# EAGLE design Teensy4Breakout (EAGLE 8.6.0)
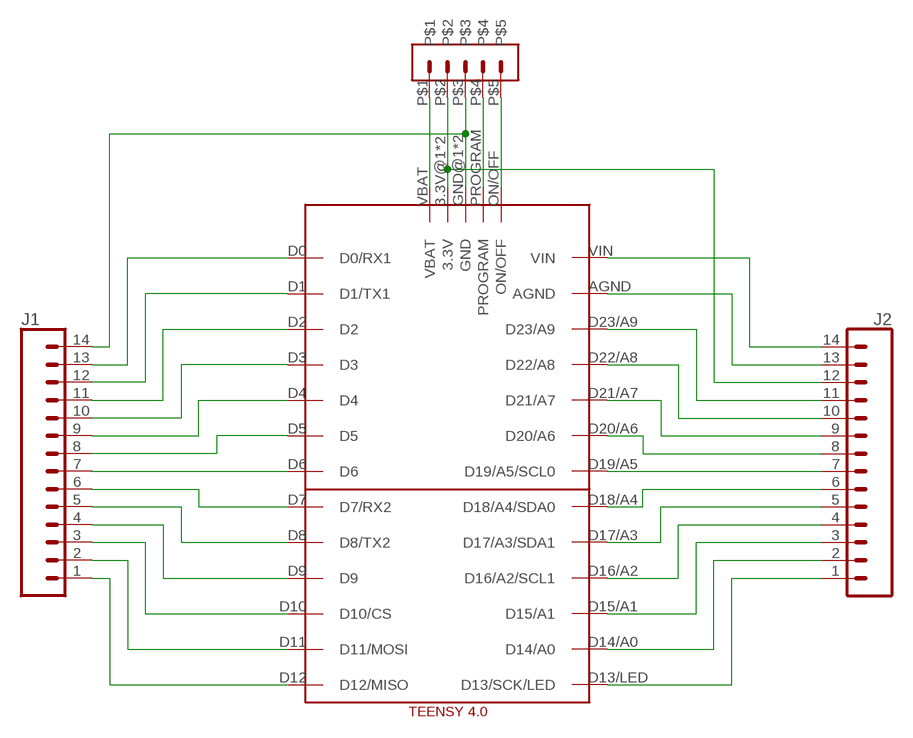
[diagram p0: schematic, sheet 1]

## Parts
J1  CONN_14LONGPADS  [1X14-LONGPADS]
J2  CONN_14LONGPADS  [1X14-LONGPADS]
U$1  HEADER1X5  [HEADER1X5]
U$4  TEENSY4.0-NOPOGO  [TEENSY4.0-NOPOGO]

## Nets
N$1: U$1.P$1 U$4.VBAT
N$2: J2.12 U$1.P$2 U$4.3.3V@1(3.3V) U$4.3.3V@2(3.3V)
N$3: J1.14 U$1.P$3 U$4.GND@1(GND) U$4.GND@2(GND)
N$4: U$1.P$4 U$4.PROGRAM
N$5: U$1.P$5 U$4.ON/OFF
N$6: J1.11 U$4.D2
N$7: J1.13 U$4.D0(D0/RX1)
N$8: J1.12 U$4.D1(D1/TX1)
N$9: J1.10 U$4.D3
N$10: J1.9 U$4.D4
N$11: J1.8 U$4.D5
N$12: J1.7 U$4.D6
N$13: J1.6 U$4.D7(D7/RX2)
N$14: J1.5 U$4.D8(D8/TX2)
N$15: J1.4 U$4.D9
N$16: J1.3 U$4.D10(D10/CS)
N$17: J1.2 U$4.D11(D11/MOSI)
N$18: J1.1 U$4.D12(D12/MISO)
N$19: J2.14 U$4.VIN
N$20: J2.13 U$4.AGND
N$21: J2.11 U$4.D23/A9
N$22: J2.10 U$4.D22/A8
N$23: J2.9 U$4.D21/A7
N$24: J2.8 U$4.D20/A6
N$25: J2.7 U$4.D19/A5(D19/A5/SCL0)
N$26: J2.6 U$4.D18/A4(D18/A4/SDA0)
N$27: J2.5 U$4.D17/A3(D17/A3/SDA1)
N$28: J2.4 U$4.D16/A2(D16/A2/SCL1)
N$29: J2.3 U$4.D15/A1
N$30: J2.2 U$4.D14/A0
N$31: J2.1 U$4.D13/LED(D13/SCK/LED)

## Library data of the parts
J1 J2 = SparkFun-Connectors:CONN_14: Multi connection point. Often used as Generic Header-pin footprint for 0.1 inch spaced/style header connections On any of the 0.1 inch spaced packages, you can populate with these: Break Away Headers - Straight <https://www.sparkfun.com/products/116> (PRT-00116) Break Away Male Headers - Right Angle <https://www.sparkfun.com/products/553> (PRT-00553) Female Headers <https://www.sparkfun.com/products/115> (PRT-00115) Break Away Headers - Machine Pin <https://www.sparkfun.com/products/117> (PRT-00117) Break Away Female Headers - Swiss Machine Pin <https://www.sparkfun.com/products/743> (PRT-00743) For SCREWTERMINALS and SPRING TERMINALS visit here: Screw Terimnals on SparkFun.com <https://www.sparkfun.com/search/results?term=Screw+Terminals> (5mm/3.5mm/2.54mm spacing) This device is also useful as a general connection point to wire up your design to another part of your project. Our various solder wires solder well into these plated through hole pads. Hook-Up Wire - Assortment (Stranded, 22 AWG) <https://www.sparkfun.com/products/11375> (PRT-11375) Hook-Up Wire - Assortment (Solid Core, 22 AWG) <https://www.sparkfun.com/products/11367> (PRT-11367) View the entire wire category on our website here <https://www.sparkfun.com/categories/141> Special notes: Molex polarized connector foot print use with SKU : PRT-08231 with associated crimp pins and housings. 1MM SMD Version SKU: PRT-10208 NOTES ON THE VARIANTS LOCK and LOCK_LONGPADS... This footprint was designed to help hold the alignment of a through-hole component (i.e. 6-pin header) while soldering it into place. You may notice that each hole has been shifted either up or down by 0.005 of an inch from it's more standard position (which is a perfectly straight line). This slight alteration caused the pins (the squares in the middle) to touch the edges of the holes. Because they are alternating, it causes a "brace" to hold the component in place. 0.005 has proven to be the perfect amount of "off-center" position when using our standard breakaway headers. Although looks a little odd when you look at the bare footprint, once you have a header in there, the alteration is very hard to notice. Also,if you push a header all the way into place, it is covered up entirely on the bottom side.
U$1 = BantamLibrary:HEADER1X5
U$4 = Teensy4.0FULL:TEENSY4.0-NOPOGO

## Board
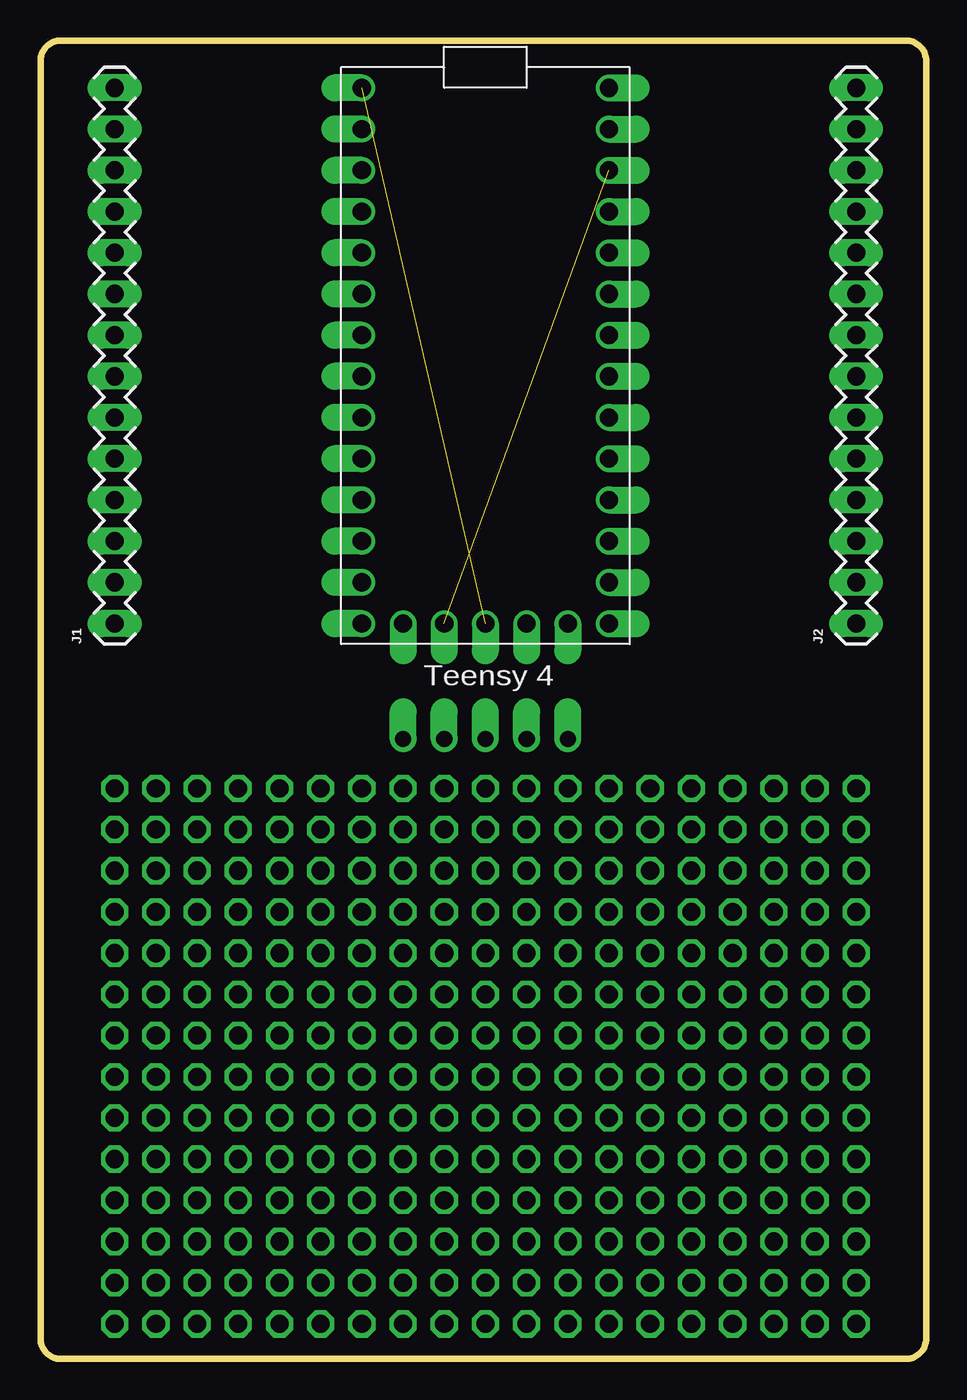
[diagram p1: board, top side]
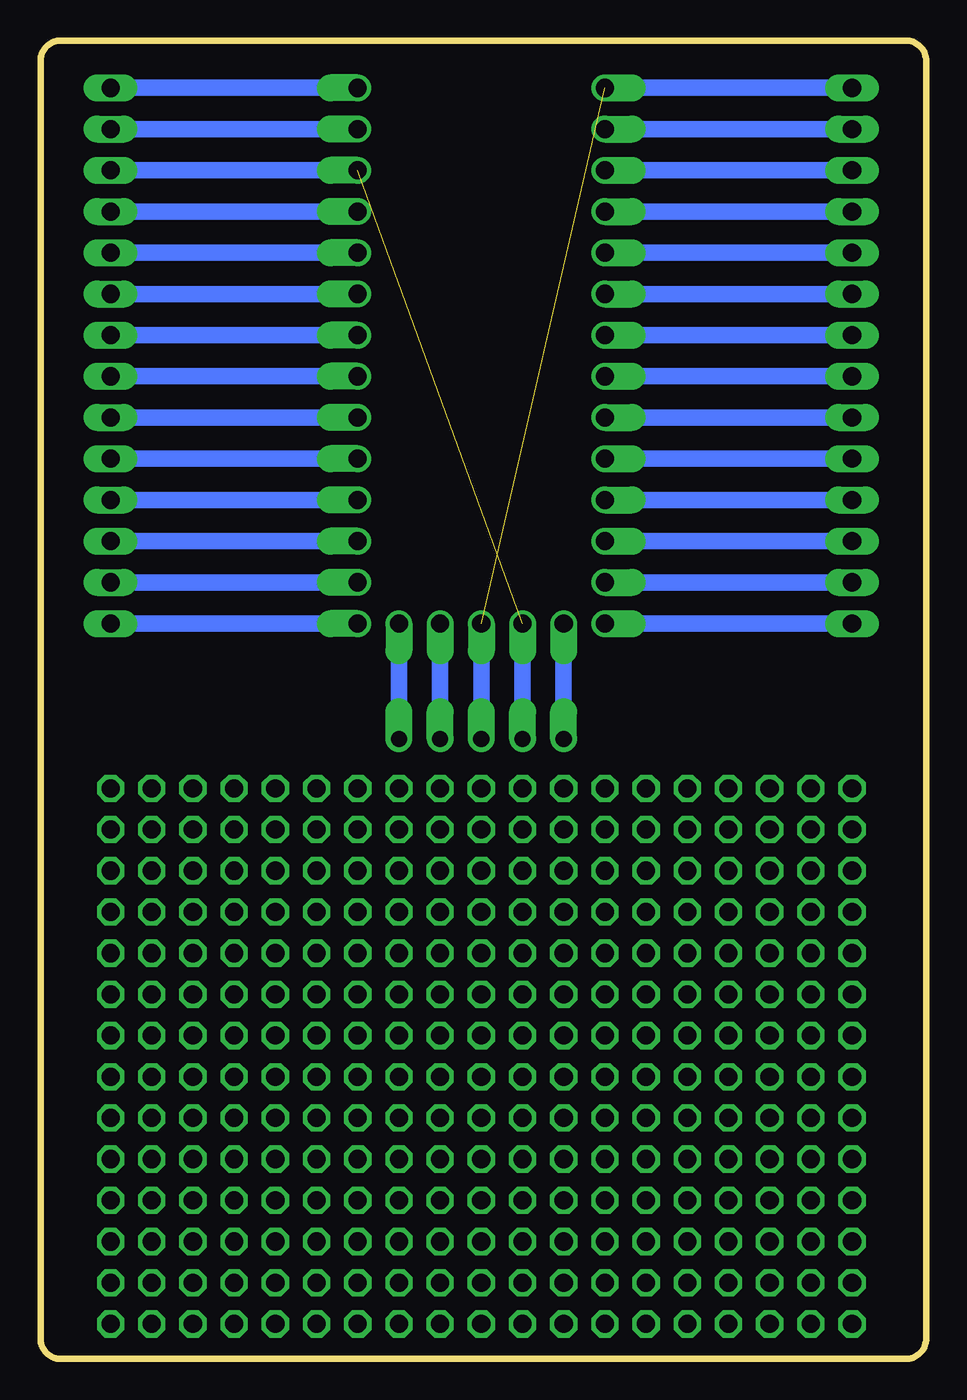
[diagram p2: board, bottom side, seen from below]

Size 54.61 x 81.28 mm. Coordinates in mm from the lower left corner, seen from the top.
Outline: 0,80.01 0,1.27 arc90 1.27,0 53.34,0 arc90 54.61,1.27 54.61,80.01 arc90 53.34,81.28 1.27,81.28 arc90 0,80.01
Copper layers (1*16): Top 0.035mm / dielectric 1.5mm / Bottom 0.035mm
Design rules "default": minimum track width 6mil, minimum drill 0.35mm, track to track 6mil, track to pad 6mil, pad to pad 6mil, via to via 6mil, smd to smd 6mil, copper to edge 40mil, drill to drill 6mil, minimum pad ring 10mil, minimum via ring 8mil, stop-mask expansion 4mil, vias tented up to drill 0mil, thermal gap 10mil

### Footprints (pad centres in the part's own frame; a part is rotated, then mirrored left to right if it is on the bottom)
1X14-LONGPADS = drill 1.118 long: 1 0,0; 2 2.54,0; 3 5.08,0; 4 7.62,0; 5 10.16,0; 6 12.7,0; 7 15.24,0; 8 17.78,0; 9 20.32,0; 10 22.86,0; 11 25.4,0; 12 27.94,0; 13 30.48,0; 14 33.02,0
HEADER1X5 = drill 1 pad 1.676 offset: P$1 -6.35,0; P$2 -3.81,0; P$3 -1.27,0; P$4 1.27,0; P$5 3.81,0
TEENSY4.0-NOPOGO = drill 1.118 offset: 3.3V@1 11.43,13.97; 3.3V@2 1.27,-13.97; AGND 11.43,16.51; D0 -3.81,16.51; D1 -3.81,13.97; D2 -3.81,11.43; D3 -3.81,8.89; D4 -3.81,6.35; D5 -3.81,3.81; D6 -3.81,1.27; D7 -3.81,-1.27; D8 -3.81,-3.81; D9 -3.81,-6.35; D10 -3.81,-8.89; D11 -3.81,-11.43; D12 -3.81,-13.97; D13/LED 11.43,-13.97; D14/A0 11.43,-11.43; D15/A1 11.43,-8.89; D16/A2 11.43,-6.35; D17/A3 11.43,-3.81; D18/A4 11.43,-1.27; D19/A5 11.43,1.27; D20/A6 11.43,3.81; D21/A7 11.43,6.35; D22/A8 11.43,8.89; D23/A9 11.43,11.43; GND@1 -3.81,19.05; GND@2 3.81,-13.97; ON/OFF 8.89,-13.97; PROGRAM 6.35,-13.97; VBAT -1.27,-13.97; VIN 11.43,19.05 | drill 1.118 pad 1.676 octagon: P$1 11.43,-24.13; P$2 13.97,-24.13; P$3 16.51,-24.13; P$4 19.05,-24.13; P$5 21.59,-24.13; P$6 26.67,-24.13; P$7 24.13,-24.13; P$22 26.67,-57.15; P$23 26.67,-54.61; P$24 26.67,-52.07; P$25 26.67,-49.53; P$26 26.67,-46.99; P$27 26.67,-44.45; P$28 26.67,-41.91; P$29 26.67,-39.37; P$30 26.67,-36.83; P$31 26.67,-34.29; P$32 26.67,-31.75; P$33 26.67,-29.21; P$34 26.67,-26.67; P$35 24.13,-26.67; P$36 24.13,-31.75; P$37 24.13,-29.21; P$38 24.13,-34.29; P$39 24.13,-36.83; P$40 24.13,-39.37; P$41 24.13,-41.91; P$42 24.13,-44.45; P$43 24.13,-46.99; P$44 24.13,-49.53; P$45 24.13,-52.07; P$46 24.13,-54.61; P$47 24.13,-57.15; P$48 21.59,-57.15; P$49 21.59,-54.61; P$50 21.59,-52.07; P$51 21.59,-49.53; P$52 21.59,-46.99; P$53 21.59,-44.45; P$54 21.59,-41.91; P$55 21.59,-39.37; P$56 21.59,-36.83; P$57 21.59,-34.29; P$58 21.59,-31.75; P$59 21.59,-29.21; P$60 21.59,-26.67; P$61 19.05,-26.67; P$62 19.05,-29.21; P$63 19.05,-31.75; P$64 19.05,-34.29; P$65 19.05,-36.83; P$66 19.05,-39.37; P$67 19.05,-41.91; P$68 19.05,-44.45; P$69 19.05,-46.99; P$70 19.05,-49.53; P$71 19.05,-52.07; P$72 19.05,-54.61; P$73 19.05,-57.15; P$74 16.51,-57.15; P$75 16.51,-54.61; P$76 16.51,-52.07; P$77 16.51,-49.53; P$78 16.51,-46.99; P$79 16.51,-44.45; P$80 16.51,-41.91; P$81 16.51,-39.37; P$82 16.51,-36.83; P$83 16.51,-34.29; P$84 16.51,-31.75; P$85 16.51,-29.21; P$86 16.51,-26.67; P$87 13.97,-26.67; P$88 11.43,-26.67; P$89 11.43,-29.21; P$90 13.97,-29.21; P$91 11.43,-31.75; P$92 13.97,-31.75; P$93 11.43,-34.29; P$94 13.97,-34.29; P$95 11.43,-36.83; P$96 13.97,-36.83; P$97 11.43,-39.37; P$98 13.97,-39.37; P$99 11.43,-41.91; P$100 13.97,-41.91; P$101 11.43,-44.45; P$102 13.97,-44.45; P$103 11.43,-46.99; P$104 13.97,-46.99; P$105 11.43,-49.53; P$106 13.97,-49.53; P$107 11.43,-52.07; P$108 13.97,-52.07; P$109 13.97,-54.61; P$110 11.43,-54.61; P$111 11.43,-57.15; P$112 13.97,-57.15; P$113 8.89,-24.13; P$114 6.35,-24.13; P$115 8.89,-26.67; P$116 6.35,-26.67; P$117 8.89,-29.21; P$118 6.35,-29.21; P$119 8.89,-31.75; P$120 6.35,-31.75; P$121 8.89,-34.29; P$122 6.35,-34.29; P$123 8.89,-36.83; P$124 6.35,-36.83; P$125 8.89,-39.37; P$126 6.35,-39.37; P$127 8.89,-41.91; P$128 6.35,-41.91; P$129 8.89,-44.45; P$130 6.35,-44.45; P$131 8.89,-46.99; P$132 6.35,-46.99; P$133 8.89,-49.53; P$134 6.35,-49.53; P$135 8.89,-52.07; P$136 6.35,-52.07; P$137 8.89,-54.61; P$138 6.35,-54.61; P$139 8.89,-57.15; P$140 6.35,-57.15; P$141 -13.97,-24.13; P$142 -11.43,-24.13; P$143 -8.89,-24.13; P$144 -6.35,-24.13; P$145 -3.81,-24.13; P$146 1.27,-24.13; P$147 -1.27,-24.13; P$148 3.81,-24.13; P$149 3.81,-26.67; P$150 3.81,-29.21; P$151 3.81,-31.75; P$152 3.81,-34.29; P$153 3.81,-36.83; P$154 3.81,-39.37; P$155 3.81,-41.91; P$156 3.81,-44.45; P$157 3.81,-46.99; P$158 3.81,-49.53; P$159 3.81,-52.07; P$160 3.81,-54.61; P$161 3.81,-57.15; P$162 1.27,-57.15; P$163 1.27,-54.61; P$164 1.27,-52.07; P$165 1.27,-49.53; P$166 1.27,-46.99; P$167 1.27,-44.45; P$168 1.27,-41.91; P$169 1.27,-39.37; P$170 1.27,-36.83; P$171 1.27,-34.29; P$172 1.27,-31.75; P$173 1.27,-29.21; P$174 1.27,-26.67; P$175 -1.27,-26.67; P$176 -1.27,-31.75; P$177 -1.27,-29.21; P$178 -1.27,-34.29; P$179 -1.27,-36.83; P$180 -1.27,-39.37; P$181 -1.27,-41.91; P$182 -1.27,-44.45; P$183 -1.27,-46.99; P$184 -1.27,-49.53; P$185 -1.27,-52.07; P$186 -1.27,-54.61; P$187 -1.27,-57.15; P$188 -3.81,-57.15; P$189 -3.81,-54.61; P$190 -3.81,-52.07; P$191 -3.81,-49.53; P$192 -3.81,-46.99; P$193 -3.81,-44.45; P$194 -3.81,-41.91; P$195 -3.81,-39.37; P$196 -3.81,-36.83; P$197 -3.81,-34.29; P$198 -3.81,-31.75; P$199 -3.81,-29.21; P$200 -3.81,-26.67; P$201 -6.35,-26.67; P$202 -6.35,-29.21; P$203 -6.35,-31.75; P$204 -6.35,-34.29; P$205 -6.35,-36.83; P$206 -6.35,-39.37; P$207 -6.35,-41.91; P$208 -6.35,-44.45; P$209 -6.35,-46.99; P$210 -6.35,-49.53; P$211 -6.35,-52.07; P$212 -6.35,-54.61; P$213 -6.35,-57.15; P$214 -8.89,-57.15; P$215 -8.89,-54.61; P$216 -8.89,-52.07; P$217 -8.89,-49.53; P$218 -8.89,-46.99; P$219 -8.89,-44.45; P$220 -8.89,-41.91; P$221 -8.89,-39.37; P$222 -8.89,-36.83; P$223 -8.89,-34.29; P$224 -8.89,-31.75; P$225 -8.89,-29.21; P$226 -8.89,-26.67; P$227 -11.43,-26.67; P$228 -13.97,-26.67; P$229 -13.97,-29.21; P$230 -11.43,-29.21; P$231 -13.97,-31.75; P$232 -11.43,-31.75; P$233 -13.97,-34.29; P$234 -11.43,-34.29; P$235 -13.97,-36.83; P$236 -11.43,-36.83; P$237 -13.97,-39.37; P$238 -11.43,-39.37; P$239 -13.97,-41.91; P$240 -11.43,-41.91; P$241 -13.97,-44.45; P$242 -11.43,-44.45; P$243 -13.97,-46.99; P$244 -11.43,-46.99; P$245 -13.97,-49.53; P$246 -11.43,-49.53; P$247 -13.97,-52.07; P$248 -11.43,-52.07; P$249 -11.43,-54.61; P$250 -13.97,-54.61; P$251 -13.97,-57.15; P$252 -11.43,-57.15; P$253 -16.51,-24.13; P$254 -19.05,-24.13; P$255 -16.51,-26.67; P$256 -19.05,-26.67; P$257 -16.51,-29.21; P$258 -19.05,-29.21; P$259 -16.51,-31.75; P$260 -19.05,-31.75; P$261 -16.51,-34.29; P$262 -19.05,-34.29; P$263 -16.51,-36.83; P$264 -19.05,-36.83; P$265 -16.51,-39.37; P$266 -19.05,-39.37; P$267 -16.51,-41.91; P$268 -19.05,-41.91; P$269 -16.51,-44.45; P$270 -19.05,-44.45; P$271 -16.51,-46.99; P$272 -19.05,-46.99; P$273 -16.51,-49.53; P$274 -19.05,-49.53; P$275 -16.51,-52.07; P$276 -19.05,-52.07; P$277 -16.51,-54.61; P$278 -19.05,-54.61; P$279 -16.51,-57.15; P$280 -19.05,-57.15

### Placement (x,y rotation side)
J1  4.57,45.34 90 top
J2  50.29,45.34 90 top
U$1  28.7,38.23 0 top
U$4  23.62,59.31 0 top

### Tracks (layer width: path | path; a pad name or v marks a point on that pad's centre or on a via)
N$1
  Bottom 1.016: U$4.VBAT U$1.P$1
N$2  (1 unrouted)
  Bottom 1.016: U$4.3.3V@1 J2.12 | U$1.P$2 U$4.3.3V@2
N$3  (1 unrouted)
  Bottom 1.016: U$4.GND@1 J1.14 | U$4.GND@2 U$1.P$3
N$4
  Bottom 1.016: U$1.P$4 U$4.PROGRAM
N$5
  Bottom 1.016: U$4.ON/OFF U$1.P$5
N$6
  Bottom 1.016: U$4.D2 J1.11
N$7
  Bottom 1.016: U$4.D0 J1.13
N$8
  Bottom 1.016: J1.12 U$4.D1
N$9
  Bottom 1.016: J1.10 U$4.D3
N$10
  Bottom 1.016: U$4.D4 J1.9
N$11
  Bottom 1.016: J1.8 U$4.D5
N$12
  Bottom 1.016: J1.7 U$4.D6
N$13
  Bottom 1.016: J1.6 U$4.D7
N$14
  Bottom 1.016: J1.5 U$4.D8
N$15
  Bottom 1.016: J1.4 U$4.D9
N$16
  Bottom 1.016: J1.3 U$4.D10
N$17
  Bottom 1.016: J1.2 U$4.D11
N$18
  Bottom 1.016: J1.1 U$4.D12
N$19
  Bottom 1.016: J2.14 U$4.VIN
N$20
  Bottom 1.016: J2.13 U$4.AGND
N$21
  Bottom 1.016: J2.11 U$4.D23/A9
N$22
  Bottom 1.016: U$4.D22/A8 J2.10
N$23
  Bottom 1.016: J2.9 U$4.D21/A7
N$24
  Bottom 1.016: U$4.D20/A6 J2.8
N$25
  Bottom 1.016: J2.7 U$4.D19/A5
N$26
  Bottom 1.016: U$4.D18/A4 J2.6
N$27
  Bottom 1.016: J2.5 U$4.D17/A3
N$28
  Bottom 1.016: J2.4 U$4.D16/A2
N$29
  Bottom 1.016: U$4.D15/A1 J2.3
N$30
  Bottom 1.016: J2.2 U$4.D14/A0
N$31
  Bottom 1.016: U$4.D13/LED J2.1